# Altium schematic sheet breakout.SchDoc
size A
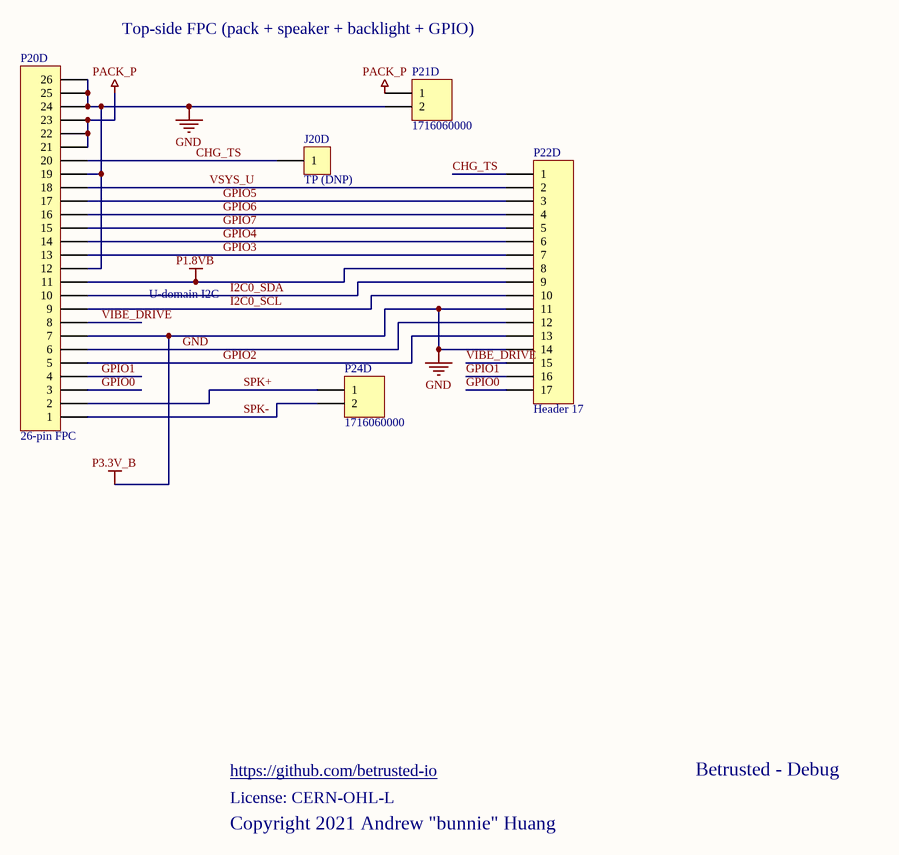
[diagram p0: breakout.SchDoc]

## Parts
J20D  TP (DNP)  [RESTAP-0603]
P20D  26-pin FPC  [HRS_FH34SRJ-26S-0.5SH(50)]
P21D  1716060000  [weidmuller_1716060000]
P22D  Header 17  [HDR1X17]
P24D  1716060000  [weidmuller_1716060000]

## Nets
GND: P20D.6 P20D.7 P20D.12 P20D.19 P20D.24 P20D.25 P20D.26 P21D.2 P22D.11 P22D.12 P22D.14  [also labelled P3.3V_B]
P1.8VB: P20D.11 P22D.8
PACK_P: P20D.21 P20D.22 P20D.23 P21D.1
CHG_TS: J20D.1 P20D.20 P22D.1
GPIO0: P20D.3 P22D.17
GPIO1: P20D.4 P22D.16
GPIO2: P20D.5 P22D.13
GPIO3: P20D.13 P22D.7
GPIO4: P20D.14 P22D.6
GPIO5: P20D.17 P22D.3
GPIO6: P20D.16 P22D.4
GPIO7: P20D.15 P22D.5
I2C0_SCL: P20D.9 P22D.10
I2C0_SDA: P20D.10 P22D.9
SPK+: P20D.2 P24D.1
SPK-: P20D.1 P24D.2
VIBE_DRIVE: P20D.8 P22D.15
VSYS_U: P20D.18 P22D.2

## Notes on the sheet
- Top-side FPC (pack + speaker + backlight + GPIO)
- U-domain I2C
- License: CERN-OHL-L
- Copyright 2021 Andrew "bunnie" Huang
- https://github.com/betrusted-io
- Betrusted - Debug

## Library data of the parts
J20D = CON1: Connector; MYPN: J-TP-PWRTAP-0603; MPN: DNP; VENDOR: DNP
P20D = FPC-26: 26 Pin FPC header; MPN: FH34SRJ-26S-0.5SH(99); MYPN: J-FPC-0.5mm-26-0.3mm-T/B; VENDOR: Hirose; System: Connector
P21D P24D = Header 2: Header, 2-Pin; VENDOR: Weidmuller; MYPN: J-TB-2P-5.08; LatestRevisionDate: 17-Jul-2002; LatestRevisionNote: Re-released for DXP Platform.; Publisher: Altium Limited; MPN: 1716060000
P22D = Header 17: Header, 17-Pin; LatestRevisionDate: 17-Jul-2002; LatestRevisionNote: Re-released for DXP Platform.; Publisher: Altium Limited